# EAGLE design hot_spring (EAGLE 6.5.0)
AUTHOR: Brad Campbell; REV: A; TITLE: Hot Spring
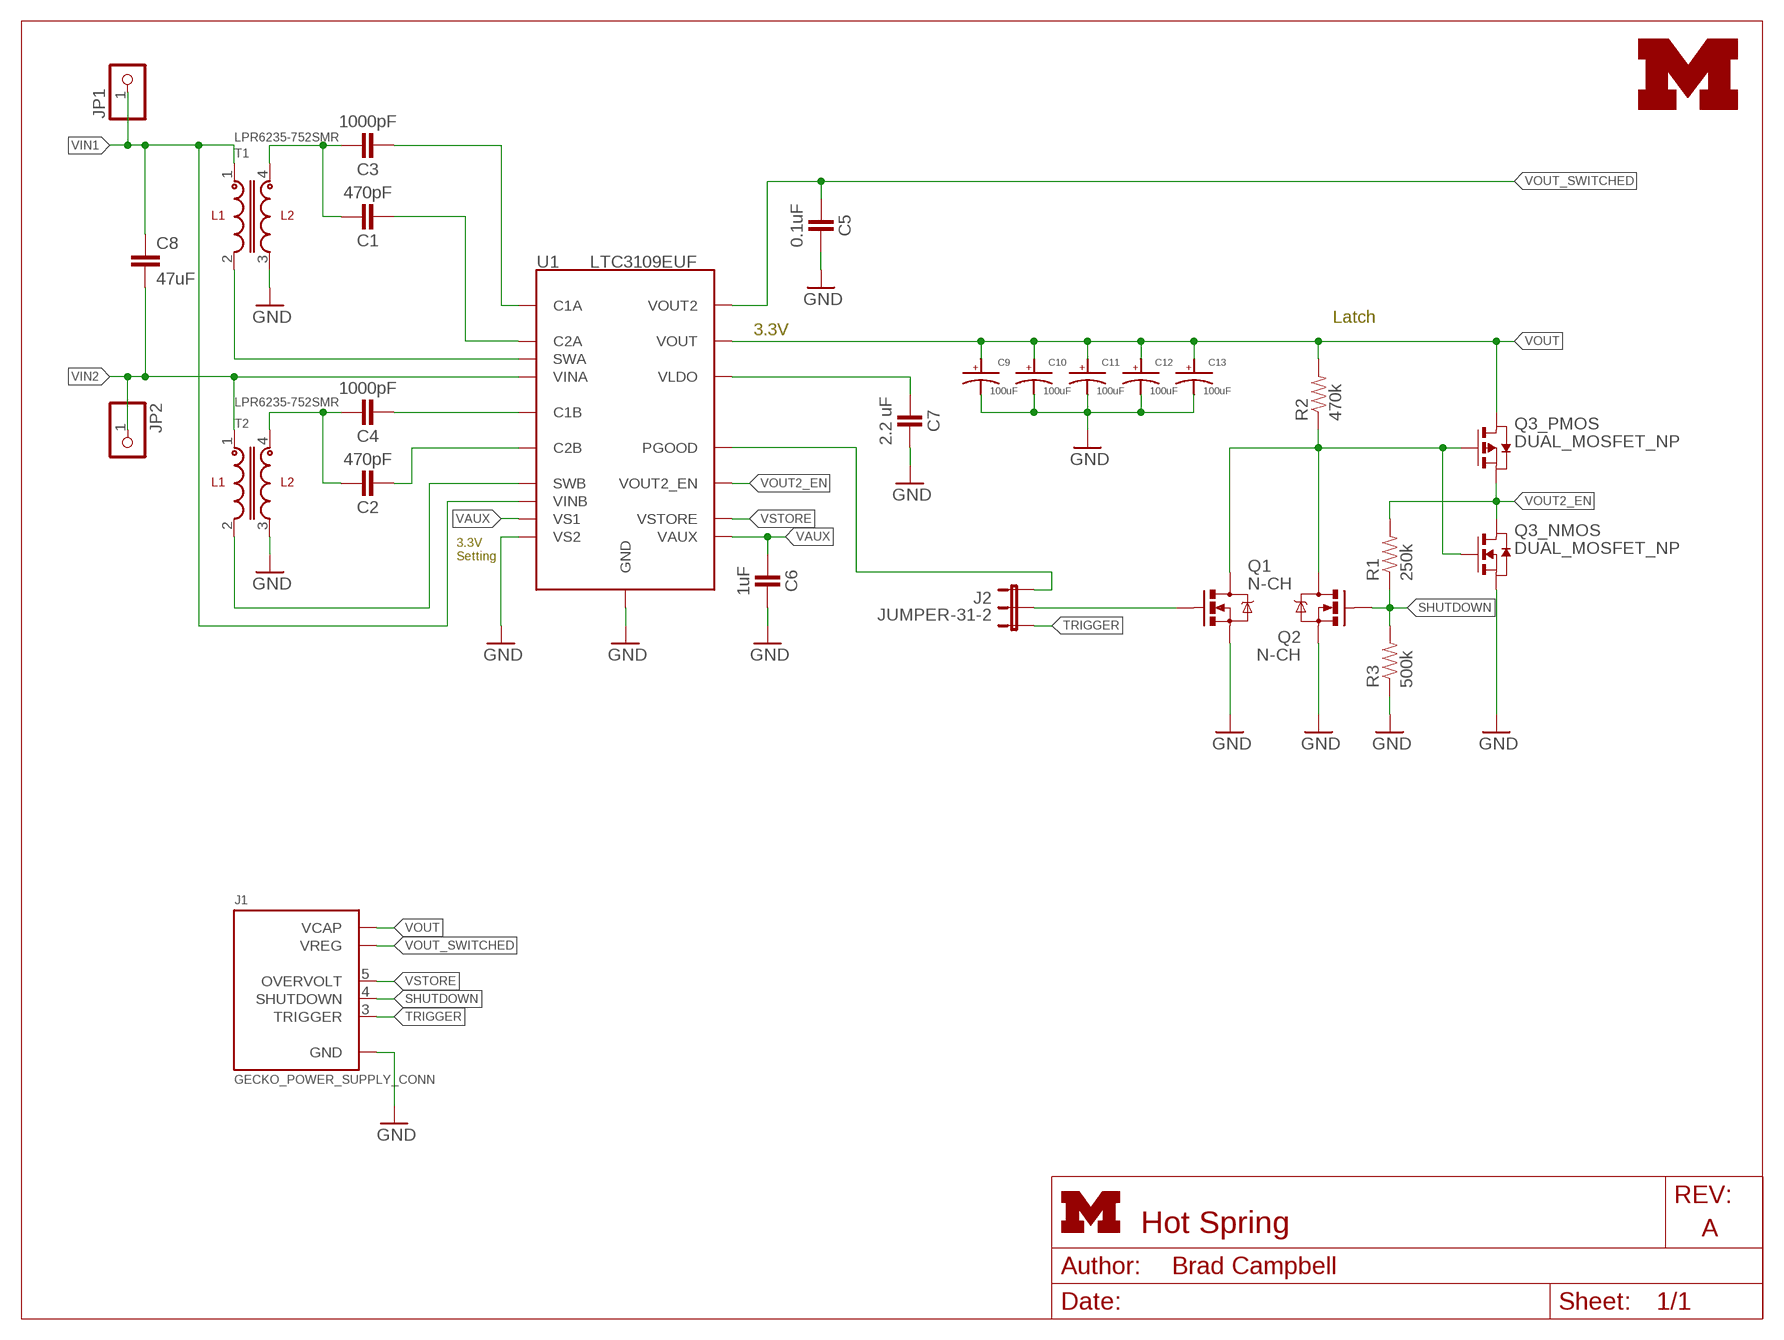
[diagram p0: schematic, sheet 1]
FRAME1 (LETTER_L): HEIGHT: 8.5in; WIDTH: 11in

## Parts
C1  470pF  CAPACITOR  [0402_CAP]
C2  470pF  CAPACITOR  [0402_CAP]
C3  1000pF  CAPACITOR  [0402_CAP]
C4  1000pF  CAPACITOR  [0402_CAP]
C5  0.1uF  CAPACITOR  [0402_CAP]
C6  1uF  CAPACITOR  [0402_CAP]
C7  2.2 uF  CAPACITOR  [0402_CAP]
C8  47uF  CAP1210  [1210]
C9  100uF  1210_CAP_POLARIZED  [CAP1210]
C10  100uF  1210_CAP_POLARIZED  [CAP1210]
C11  100uF  1210_CAP_POLARIZED  [CAP1210]
C12  100uF  1210_CAP_POLARIZED  [CAP1210]
C13  100uF  1210_CAP_POLARIZED  [CAP1210]
J1  GECKO_POWER_SUPPLY_CONN  [HEADER1X6/0.05IN]
J2  JUMPER-31-2  [SJ_3_PASTE1&2]
JP1  PINHD-1X1  [1X01]
JP2  PINHD-1X1  [1X01]
LOGO1  UMICH_SOLID_SMALL  [UMICH_SOLID_75MIL]
Q1  MOSFET-NCHANNELSMD  [SOT23-3]
Q2  MOSFET-NCHANNELSMD  [SOT23-3]
Q3  DUAL_MOSFET_NP  [TSOP-6]
R1  250k  RESISTOR0402_RES  [0402_RES]
R2  470k  RESISTOR0402_RES  [0402_RES]
R3  500k  RESISTOR0402_RES  [0402_RES]
T1  LPR6235-752SMR  [LPR6235]
T2  LPR6235-752SMR  [LPR6235]
U1  LTC3109EUF  [QFN-20-4MM]

## Nets
GND: C5.1 C6.1 C7.1 C9.ANODE C10.ANODE C11.ANODE C12.ANODE C13.ANODE J1.1(GND) Q1.2(S) Q2.2(S) Q3.5(_NMOS:S) R3.1 T1.3 T2.3 U1.8(GND) U1.11(GND) U1.16(GND) U1.20(VS2) U1.GND
N$1: C2.1 C4.1 T2.4
N$2: C1.1 C3.1 T1.4
N$3: C3.2 U1.18(C1A)
N$4: C1.2 U1.17(C2A)
N$6: C4.2 U1.9(C1B)
N$7: C2.2 U1.10(C2B)
N$8: C7.2 U1.7(VLDO)
N$9: T1.2 U1.15(SWA)
N$10: T2.2 U1.12(SWB)
N$11: J2.2 Q1.1(G)
N$14: Q1.3(D) Q2.3(D) Q3.1(_NMOS:G) Q3.3(_PMOS:G) R2.1
PGOOD: J2.1 U1.6(PGOOD)
SHUTDOWN: J1.4(SHUTDOWN) Q2.1(G) R1.1 R3.2
TRIGGER: J1.3(TRIGGER) J2.3
VAUX: C6.2 U1.2(VAUX) U1.19(VS1)
VIN1: C8.1 JP1.1 T1.1 U1.13(VINB)
VIN2: C8.2 JP2.1 T2.1 U1.14(VINA)
VOUT: C9.CATHODE C10.CATHODE C11.CATHODE C12.CATHODE C13.CATHODE J1.6(VCAP) Q3.4(_PMOS:D) R2.2 U1.3(VOUT)
VOUT2_EN: Q3.2(_PMOS:S) Q3.6(_NMOS:D) R1.2 U1.5(VOUT2_EN)
VOUT_SWITCHED: C5.2 J1.2(VREG) U1.4(VOUT2)
VSTORE: J1.5(OVERVOLT) U1.1(VSTORE)

## Notes on the sheet
- Latch
- 3.3V
- 3.3V
  Setting
- N-CH
- N-CH

## Library data of the parts
C1 C2 = passives:CAPACITOR: 0402 Capacitor; DIGIKEY: 445-1255-1-ND
C3 C4 = passives:CAPACITOR: 0402 Capacitor; DIGIKEY: 445-1256-1-ND
C5 = passives:CAPACITOR: 0402 Capacitor; DIGIKEY: 445-4952-1-ND
C6 = passives:CAPACITOR: 0402 Capacitor; DIGIKEY: 445-13185-1-ND
C7 = passives:CAPACITOR: 0402 Capacitor; DIGIKEY: 445-4999-1-ND
C8 = SparkFun-Capacitors:CAP: Capacitor Standard 0603 ceramic capacitor, and 0.1" leaded capacitor.; DIGIKEY: 399-5515-1-ND
C9-C13 = passives:1210_CAP_POLARIZED; DIGIKEY: 478-3130-1-ND
J1 = gecko:GECKO_POWER_SUPPLY_CONN: Header on the gecko power supply board.
J2 = SparkFun-Passives:JUMPER-3
JP1 JP2 = pinhead:PINHD-1X1: PIN HEADER
LOGO1 = logos:UMICH_SOLID
Q1 Q2 = fets:MOSFET-NCHANNEL: Generic NMOS footprint; DIGIKEY: FDV301NCT-ND
Q3 = fets:DUAL_MOSFET_NP: MOSFET N/P-CH 20V 2A 6-TSOP; DIGIKEY: SI3585DV-T1-E3CT-ND
R1 = passives:RESISTOR: Resistor Basic schematic elements and footprints for 0603, 1206, and PTH resistors.; DIGIKEY: RHM249KCDCT-ND
R2 = passives:RESISTOR: Resistor Basic schematic elements and footprints for 0603, 1206, and PTH resistors.; DIGIKEY: RHM470KCDCT-ND
R3 = passives:RESISTOR: Resistor Basic schematic elements and footprints for 0603, 1206, and PTH resistors.; DIGIKEY: RHM499KCDCT-ND
T1 T2 = transformers:LPR6235: LPR6235 Miniature Step-Up Flyback Transformer 100:1; COILCRAFT: LPR6235-752SMR
U1 = chips:LTC3109: IC BOOST CONVERTER PMU 20QFN; DIGIKEY: LTC3109EUF#PBF-ND; NEWARK: 84R6674

## Board
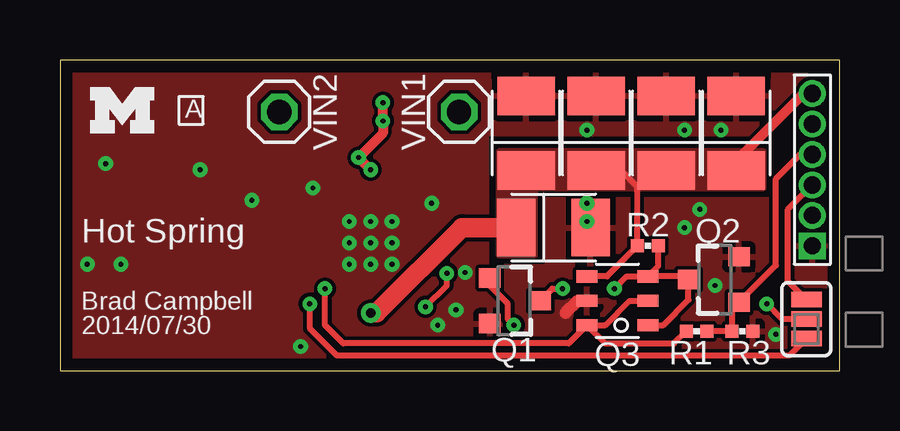
[diagram p1: board, top side]
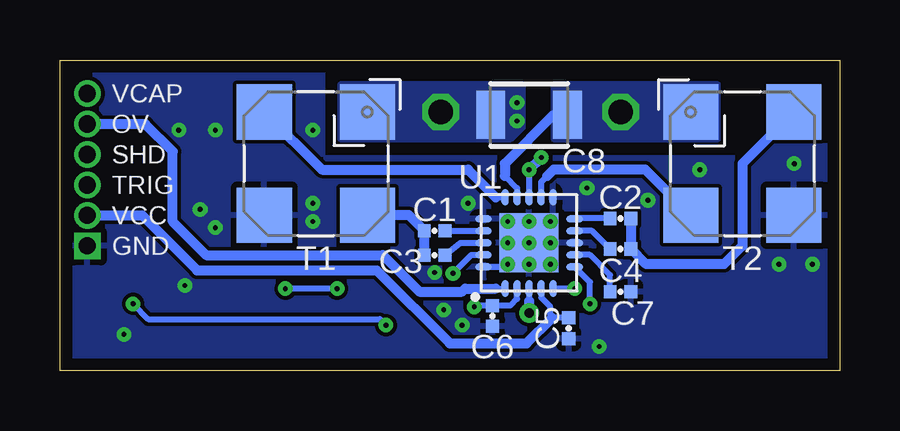
[diagram p2: board, bottom side, seen from below]

Size 32.51 x 12.95 mm. Coordinates in mm from the lower left corner, seen from the top.
Outline: 0,0 32.51,0 32.51,12.95 0,12.95 0,0
Copper layers (1*16): Top 0.0178mm / dielectric 59mil / Bottom 0.0178mm
Design rules "sunstone-2lyr_v1.0.0.3 *": minimum track width 6mil, minimum drill 14mil, track to track 6mil, track to pad 6mil, pad to pad 6mil, via to via 6mil, smd to smd 6mil, copper to edge 20mil, drill to drill 16mil, minimum pad ring 8mil, minimum via ring 8mil, stop-mask expansion 3mil, vias tented up to drill 20mil, thermal gap 10mil

### Footprints (pad centres in the part's own frame; a part is rotated, then mirrored left to right if it is on the bottom)
0402_CAP = smd 0.536 x 0.546: 1 -0.433,0; 2 0.433,0
1210 = smd 1.2 x 2: 1 -1.6,0; 2 1.6,0
CAP1210 = smd 2.4 x 1.6: ANODE 0,-1.55; CATHODE 0,1.55
HEADER1X6/0.05IN = drill 0.711 pad 1.016 square: 1 -2.54,0 | drill 0.711 pad 1.016: 2 -1.27,0; 3 0,0; 4 1.27,0; 5 2.54,0; 6 3.81,0
SJ_3_PASTE1&2 = smd 0.635 x 1.27: 1 -0.813,0; 2 0,0; 3 0.813,0
1X01 = drill 1.016 octagon: 1 0,0
SOT23-3 = smd 0.8 x 0.9: 1 -0.95,-1; 2 0.95,-1; 3 0,1.1
TSOP-6 = smd 0.508 x 0.889: 1 -1.016,-1.27; 2 0,-1.27; 3 1.016,-1.27; 4 1.016,1.27; 5 0,1.27; 6 -1.016,1.27
0402_RES = smd 0.536 x 0.546: 1 -0.433,0; 2 0.433,0
LPR6235 = smd 2.3 x 2.3: 1 -2.15,2.15; 2 -2.15,-2.15; 3 2.15,-2.15; 4 2.15,2.15
QFN-20-4MM = smd 0.7 x 0.3: 1 -1.9,1; 2 -1.9,0.5; 3 -1.9,0; 4 -1.9,-0.5; 5 -1.9,-1; 11 1.9,-1; 12 1.9,-0.5; 13 1.9,0; 14 1.9,0.5; 15 1.9,1 | smd 0.3 x 0.7: 6 -1,-1.9; 7 -0.5,-1.9; 8 0,-1.9; 9 0.5,-1.9; 10 1,-1.9; 16 1,1.9; 17 0.5,1.9; 18 0,1.9; 19 -0.5,1.9; 20 -1,1.9 | smd 2.45 x 2.45: GND 0,0

### Placement (x,y rotation side)
C1  16.89,5.84 0 bottom
C2  9.14,6.35 180 bottom
C3  16.89,4.83 0 bottom
C4  9.14,5.08 180 bottom
C5  11.3,1.78 90 bottom
C6  14.48,2.29 90 bottom
C7  9.14,3.3 180 bottom
C8  12.95,10.67 0 bottom
C9  28.19,9.91 180 top
C10  25.27,9.91 180 top
C11  22.35,9.91 180 top
C12  19.43,9.91 180 top
C13  20.57,5.97 90 top
J1  31.37,7.75 90 top
J2  31.11,2.16 90 top
JP1  16.64,10.79 0 top
JP2  9.14,10.79 0 top
LOGO1  1.27,9.91 0 top
Q1  18.92,2.92 270 top
Q2  27.3,3.81 90 top
Q3  23.24,2.92 90 top
R1  26.54,1.65 180 top
R2  24.51,5.21 180 top
R3  28.45,1.65 180 top
T1  21.84,8.64 270 bottom
T2  4.06,8.64 0 bottom
U1  12.95,5.33 90 bottom

### Tracks (layer width: path | path; a pad name or v marks a point on that pad's centre or on a via)
GND  (via drill 0.2)
  Top 0.254: Q3.5 21.59,2.92
  Top 0.508: 21.59,2.92 21.08,2.41
  Bottom 0.254: U1.20 13.95,4.33 v13.84,4.45
  other vias: 12.95,5.33 13.84,5.33 13.84,6.22 12.95,6.22 12.06,6.22 12.06,5.33 12.06,4.45 12.95,4.45 26.67,6.73 26.04,5.97 27.3,3.56 29.84,1.52 16.51,2.54 15.75,1.91 10.03,1.02 15.49,6.99 10.54,7.62 16.89,4.1 21.97,6.99 21.97,6.22 5.84,8.38 1.91,8.64 21.97,10.03 26.04,10.03 27.56,10.03 1.14,4.45 2.54,4.45 8,7.11
  pour Bottom: -1.27,13.97 -1.27,-1.27 33.02,-1.27 33.02,13.97 21.59,13.97 21.59,8.89 3.81,8.89 3.81,13.97
  pour Top: -1.27,13.97 -1.27,-1.27 33.02,-1.27 33.02,7.11 20.32,7.11 20.32,4.32 17.78,4.32 17.78,9.91 33.02,9.91 33.02,13.97
N$1
  Bottom 0.406: T2.4 4.06,8.64 4.06,5.21 4.83,4.45 8.08,4.45 C4.1 C2.1
N$2
  Bottom 0.406: T1.4 17.97,6.49 C1.1 C3.1
N$3
  Bottom 0.254: C3.2 15.82,5.33 U1.18
N$4
  Bottom 0.254: C1.2 16.32,5.83 U1.17
N$6
  Bottom 0.254: C4.2 10.33,5.83 U1.9
N$7
  Bottom 0.254: C2.2 11.04,6.35 U1.10
N$8
  Bottom 0.254: C7.2 9.58,3.99 10.42,4.83 U1.7
N$9
  Bottom 0.254: 14.35,7.23 U1.15
  Bottom 0.406: T1.2 21.59,8.38 15.49,8.38 14.35,7.23
N$10
  Bottom 0.254: 12.19,8.13 12.45,7.87 U1.12
  Bottom 0.406: T2.2 8.11,8.38 11.94,8.38 12.19,8.13
N$11  (via drill 0.2)
  Top 0.254: J2.2 30.1,2.16 v29.46,2.79 | Q1.1 17.92,3.54 18.67,2.79 18.67,2.16 v18.92,1.91
  Bottom 0.254: v29.46,2.79 28.83,2.16 19.18,2.16 v18.92,1.91
N$14  (via drill 0.2)
  Top 0.254: Q3.3 26.08,3.94 Q2.3 26.2,2.96 25.15,1.91 Q3.1 | Q1.3 20.53,3.43 v20.95,3.43 | v23.11,3.43 23.62,3.94 Q3.3 | Q3.3 24.94,4.37 R2.1
  Bottom 0.254: v20.95,3.43 v23.11,3.43
PGOOD  (via drill 0.2)
  Top 0.254: J2.1 30.4,0.64 11.56,0.64 10.41,1.78 v10.41,2.79
  Bottom 0.254: v10.41,2.79 10.41,3.69 U1.6
SHUTDOWN
  Top 0.254: J1.4 30.86,9.02 29.84,8 29.84,4.4 Q2.1 28.02,2.57 R3.2 R1.1
TRIGGER
  Top 0.254: J2.3 30.35,3.73 30.35,6.73 J1.3
VAUX  (via drill 0.2)
  Top 0.254: v15.24,2.67 16.13,3.56 v16.13,4.06
  Bottom 0.254: U1.2 13.45,3 13.74,2.72 C6.2 15.16,2.72 v15.24,2.67 | v16.13,4.06 15.36,4.83 U1.19
VIN1  (via drill 0.2)
  Top 0.406: v13.46,11.18 v13.46,10.41 13.46,9.91 v12.45,8.89 v12.95,8.38
  Bottom 0.254: v12.95,8.38 U1.13
  Bottom 0.406: v12.95,8.38 v12.45,8.89
  pour Bottom (no thermals): 13.21,11.94 20.83,11.94 20.83,9.65 13.72,9.65 13.21,10.16
VIN2
  Bottom 0.254: 13.97,8.13 13.45,7.61 U1.14
  Bottom 0.406: C8.2 11.94,10.67 13.97,8.64 13.97,8.13
  pour Bottom (no thermals): 5.08,11.94 11.94,11.94 11.94,9.65 5.08,9.65
VOUT  (via drill 0.41)
  Top 0.254: Q3.4 22.81,3.94 R2.2 24.08,7.67 23.39,8.36 C11.CATHODE
  Top 0.406: J1.6 30.99,11.56 28.19,8.76 C9.CATHODE
  Top 0.813: v12.95,2.41 13.21,2.41 16.76,5.97 C13.CATHODE
  Bottom 0.254: U1.3 12.95,2.92
  Bottom 0.406: 12.95,2.92 v12.95,2.41
  pour Top (no thermals): 18.29,9.14 18.29,4.83 19.81,4.83 19.81,7.62 29.34,7.62 29.34,9.14
VOUT2_EN  (via drill 0.2)
  Top 0.254: Q3.6 22.73,1.14 25.6,1.14 R1.2 | Q3.6 22.73,1.91 23.75,2.92 Q3.2 | Q3.6 21.21,1.14 11.81,1.14 11.05,1.91 v11.05,3.43
  Bottom 0.254: v11.05,3.43 U1.5
VOUT_SWITCHED
  Bottom 0.254: C5.2 11.99,2.21 12.06,2.29 12.06,2.67 12.45,3.05 U1.4
  Bottom 0.406: J1.2 29.08,6.48 26.8,4.19 19.3,4.19 16.26,1.14 13.06,1.14 11.99,2.21
VSTORE
  Bottom 0.254: 14.35,3.43 U1.1
  Bottom 0.406: J1.5 28.96,10.29 27.81,9.14 27.81,6.22 26.42,4.83 19.05,4.83 17.53,3.3 15.75,3.3 15.62,3.43 14.35,3.43

### Text on the board
tPlace: A | VIN2 | VIN1 | Hot Spring | Brad Campbell | 2014/07/30
bPlace: VCAP | OV | SHD | TRIG | VCC | GND
tDocu: Trigger | External | PGOOD